# EAGLE design TrackerBaseStation (EAGLE 6.2)
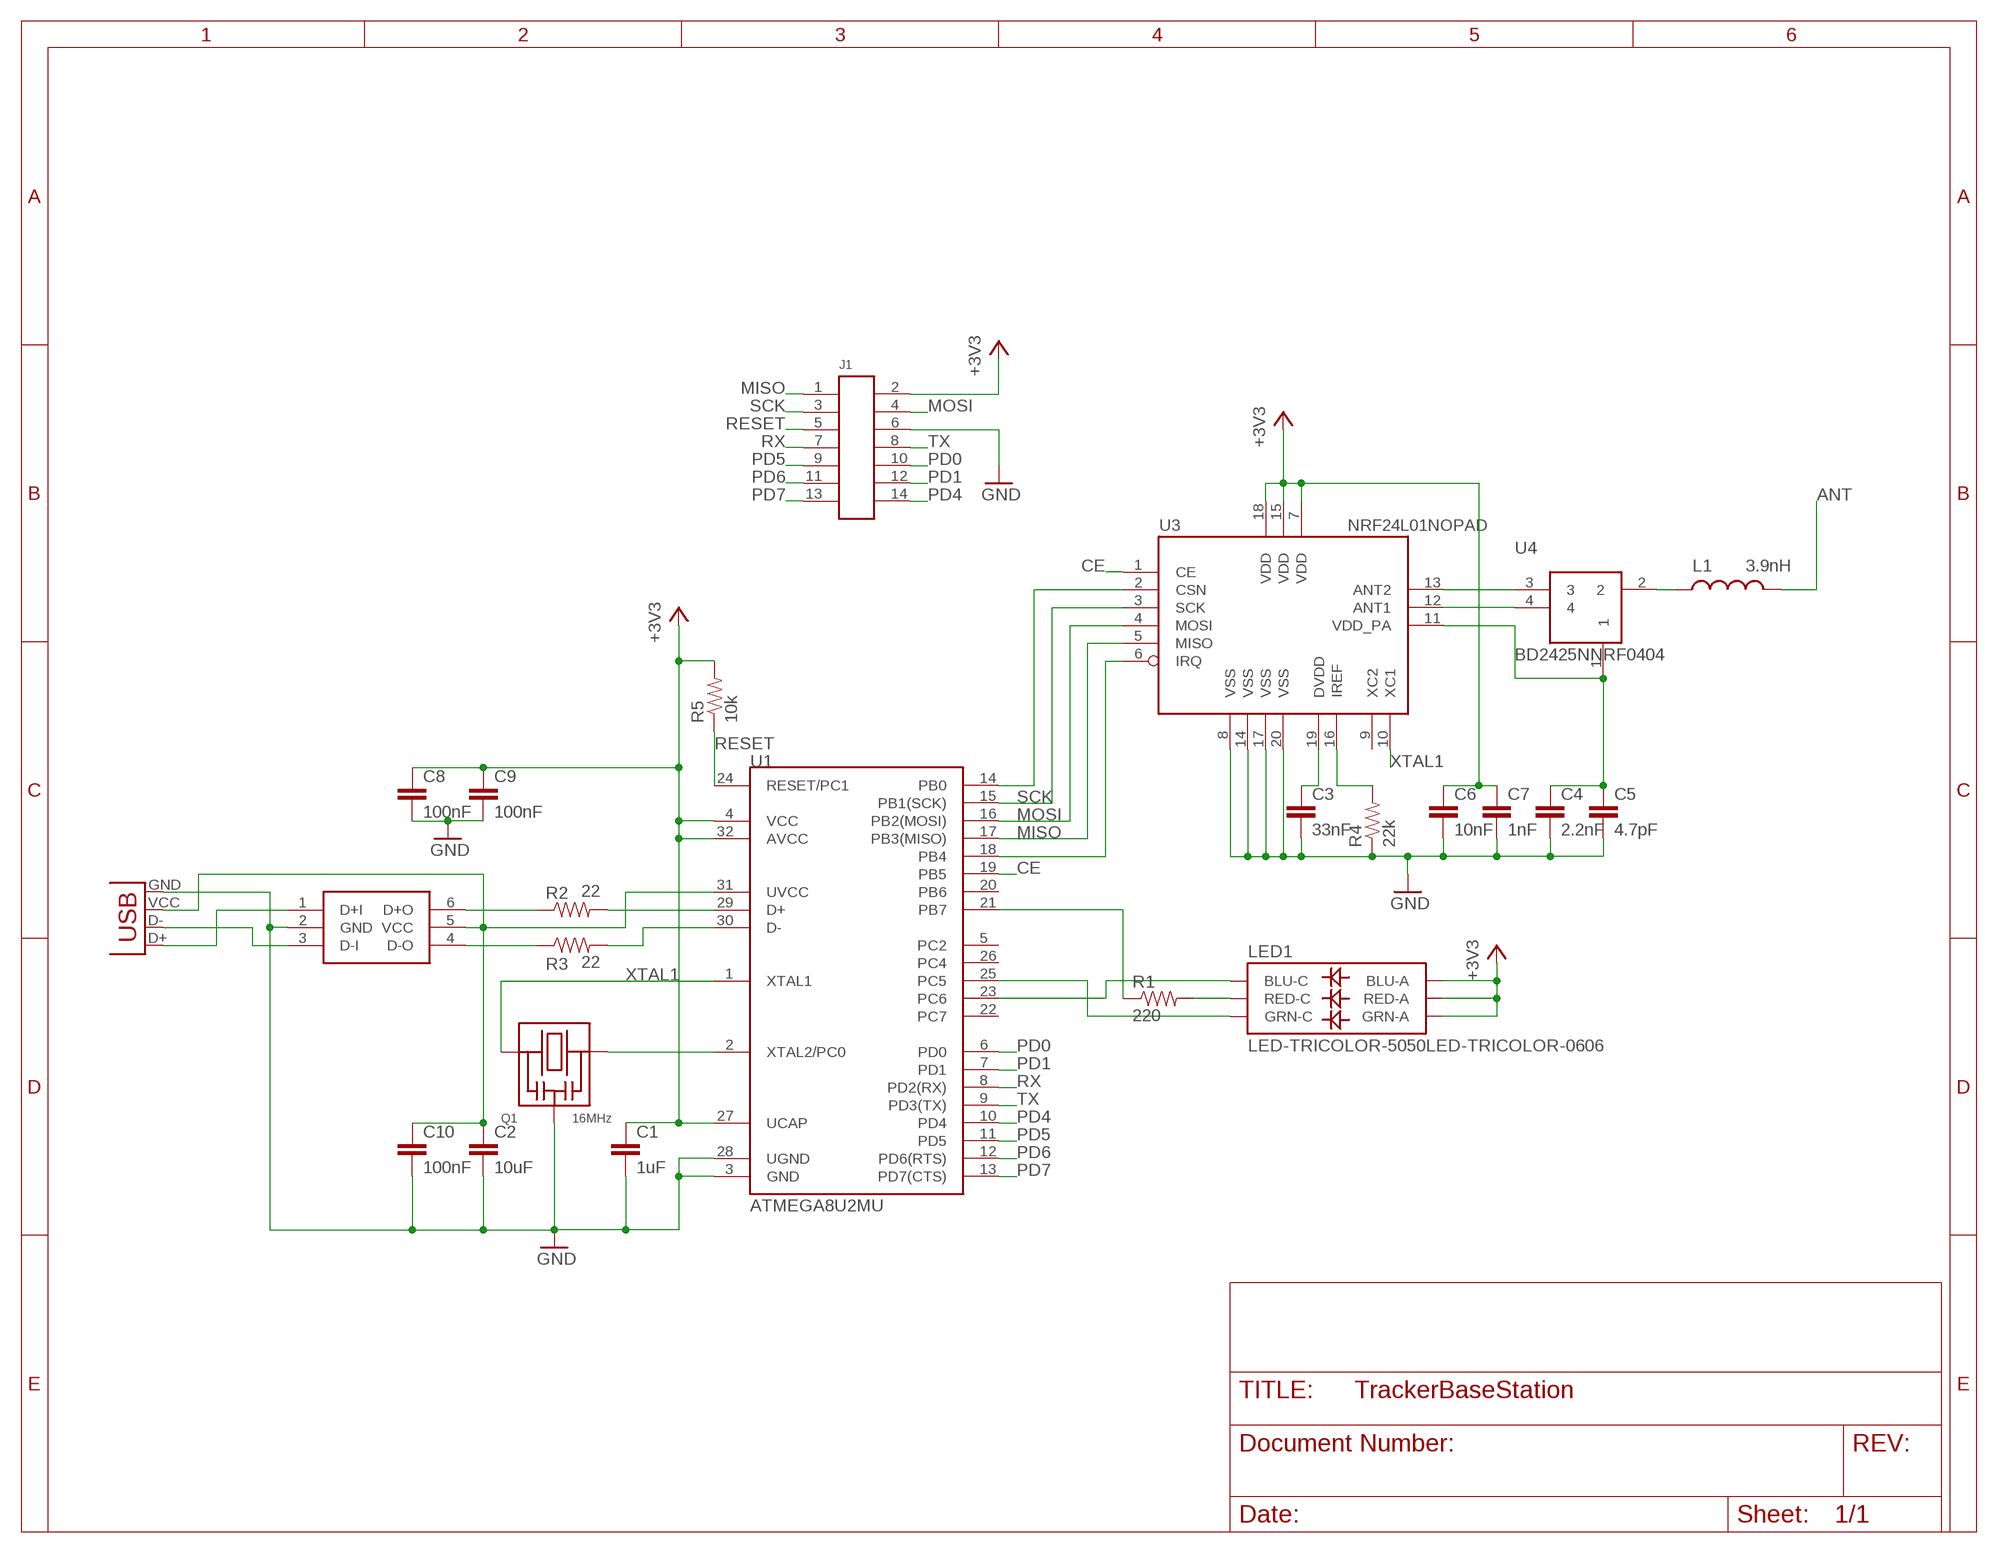
[diagram p0: schematic, sheet 1]

## Parts
C1  1uF  CAP0402-CAP  [0402-CAP]
C2  10uF  CAP0603-CAP  [0603-CAP]
C3  33nF  CAP0402-CAP  [0402-CAP]
C4  2.2nF  CAP0402-CAP  [0402-CAP]
C5  4.7pF  CAP0402-CAP  [0402-CAP]
C6  10nF  CAP0402-CAP  [0402-CAP]
C7  1nF  CAP0402-CAP  [0402-CAP]
C8  100nF  CAP0402-CAP  [0402-CAP]
C9  100nF  CAP0402-CAP  [0402-CAP]
C10  100nF  CAP0402-CAP  [0402-CAP]
J1  DF12A3.0-14DS  [DF12A3.0-14DS]
L1  3.9nH  INDUCTOR0402  [C0402]
LED1  LED-TRICOLOR-5050LED-TRICOLOR-0606  [0606]
Q1  16MHz  RESONATORPRQC  [PRQC]
R1  220  RESISTOR0402-RES  [0402-RES]
R2  22  RESISTOR0402-RES  [0402-RES]
R3  22  RESISTOR0402-RES  [0402-RES]
R4  22k  RESISTOR0402-RES  [0402-RES]
R5  10k  RESISTOR0402-RES  [0402-RES]
U1  ATMEGA8U2MU  [QFN32]
U2  RCLAMP0502A  [SOT-666]
U3  NRF24L01NOPAD  [QFN20-NOPAD]
U4  BD2425NNRF0404  [BD2425NNRF]
X1  USB-LEG  [USB-A-SMD-LEG]

## Nets
+3V3: C1.1 C6.1 C7.1 C8.1 C9.1 J1.2 LED1.4(BLU-A) LED1.5(RED-A) LED1.6(GRN-A) R5.2 U1.4(VCC) U1.27(UCAP) U1.32(AVCC) U3.7(VDD) U3.15(VDD) U3.18(VDD)
ANT: L1.2
CE: U1.19(PB5) U3.1(CE)
GND: C1.2 C2.2 C3.2 C4.2 C5.2 C6.2 C7.2 C8.2 C9.2 C10.2 J1.6 Q1.P$2(GND) R4.1 U1.3(GND) U1.28(UGND) U2.2(GND) U3.8(VSS) U3.14(VSS) U3.17(VSS) U3.20(VSS) X1.GND
MISO: J1.1 U1.17(PB3(MISO)) U3.5(MISO)
MOSI: J1.4 U1.16(PB2(MOSI)) U3.4(MOSI)
N$1: LED1.1(BLU-C) U1.23(PC6)
N$2: LED1.2(RED-C) R1.2
N$3: R1.1 U1.21(PB7)
N$4: LED1.3(GRN-C) U1.25(PC5)
N$5: Q1.P$3 U1.2(XTAL2/PC0)
N$6: U2.3(D-I) X1.D-
N$7: U2.1(D+I) X1.D+
N$8: U1.14(PB0) U3.2(CSN)
N$9: R2.1 U2.6(D+O)
N$10: R2.2 U1.29(D+)
N$11: R3.1 U2.4(D-O)
N$12: R3.2 U1.30(D-)
N$13: C2.1 C10.1 U1.31(UVCC) U2.5(VCC) X1.VCC(VBUS)
N$17: U1.18(PB4) U3.6(IRQ)
N$19: C3.1 U3.19(DVDD)
N$20: R4.2 U3.16(IREF)
N$21: U3.13(ANT2) U4.3
N$22: U3.12(ANT1) U4.4
N$23: L1.1 U4.2
N$24: C4.1 C5.1 U3.11(VDD_PA) U4.1
PD0: J1.10 U1.6(PD0)
PD1: J1.12 U1.7(PD1)
PD4: J1.14 U1.10(PD4)
PD5: J1.9 U1.11(PD5)
PD6: J1.11 U1.12(PD6(RTS))
PD7: J1.13 U1.13(PD7(CTS))
RESET: J1.5 R5.1 U1.24(RESET/PC1)
RX: J1.7 U1.8(PD2(RX))
SCK: J1.3 U1.15(PB1(SCK)) U3.3(SCK)
TX: J1.8 U1.9(PD3(TX))
XTAL1: Q1.P$1 U1.1(XTAL1) U3.10(XC1)
Unconnected: U1.5(PC2) U1.20(PB6) U1.22(PC7) U1.26(PC4) U3.9(XC2)

## Library data of the parts
C1-C3 C8-C10 = SparkFun-Passives:CAP: Capacitor Standard 0603 ceramic capacitor, and 0.1" leaded capacitor.
C4-C7 = SparkFun:CAP: Capacitor Standard 0603 ceramic capacitor, and 0.1" leaded capacitor.
J1 = adjacent-reality:DF12A3.0-14DS
L1 = adjacent-reality:INDUCTOR: Inductors Basic Inductor/Choke - 0603 and 1206. Footprints are not proven and vary greatly between part numbers. CC-BY-SA from SparkFun
LED1 = adjacent-reality:LED-TRICOLOR-5050
Q1 = adjacent-reality:RESONATOR: From UBW USB Bit Whacker by Brian Schmalz
R1-R5 = SparkFun-Passives:RESISTOR: Resistor Basic schematic elements and footprints for 0603, 1206, and PTH resistors.
U1 = adjacent-reality:ATMEGA8U2: Atmel 32-pin 8-bit Microcontroller with 8/16/32K Bystes of ISP Flash and USB Controller. ATmega8U2, ATmega16U2, and ATmega32U2 CC BY SA SparkFun
U2 = adjacent-reality:RCLAMP0502A: The RailClamp® series consists of ultra low capacitance TVS arrays designed to protect high speed data interfaces.
U3 = adjacent-reality:NRF24L01: 2.4GHz Low Power Transceiver This is the very popular, low cost, very low power RF transceiver from Nordic Semiconductor. Simple SPI interface. SKU: COM-00690 CC BY SA SparkFun
U4 = adjacent-reality:BD2425NNRF: Ultra Low Profile 0404 Balun For nRF24L01 and nRF24L01+
X1 = adjacent-reality:USB: USB Connectors USB-B-PTH is fully proven SKU : PRT-00139 USB-miniB is fully proven SKU : PRT-00587 USB-A-PCB is untested. USB-A-H is throughly reviewed, but untested. Spark Fun Electronics SKU : PRT-00437 USB-B-SMT is throughly reviewed, but untested. Needs silkscreen touching up. USB-A-S has not been used/tested USB-MB-H has not been used/tested CC BY SA SparkFun

## Board
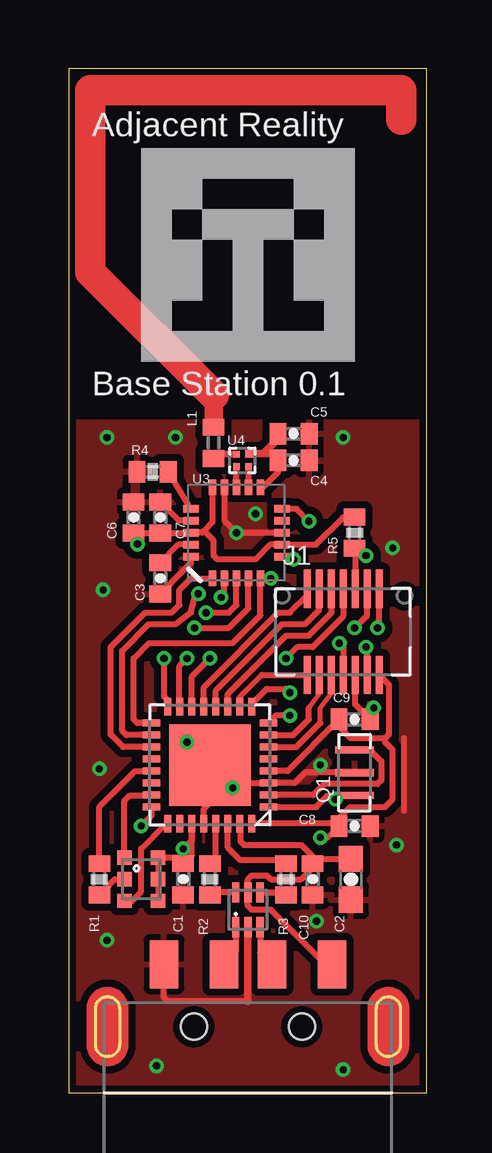
[diagram p1: board, top side]
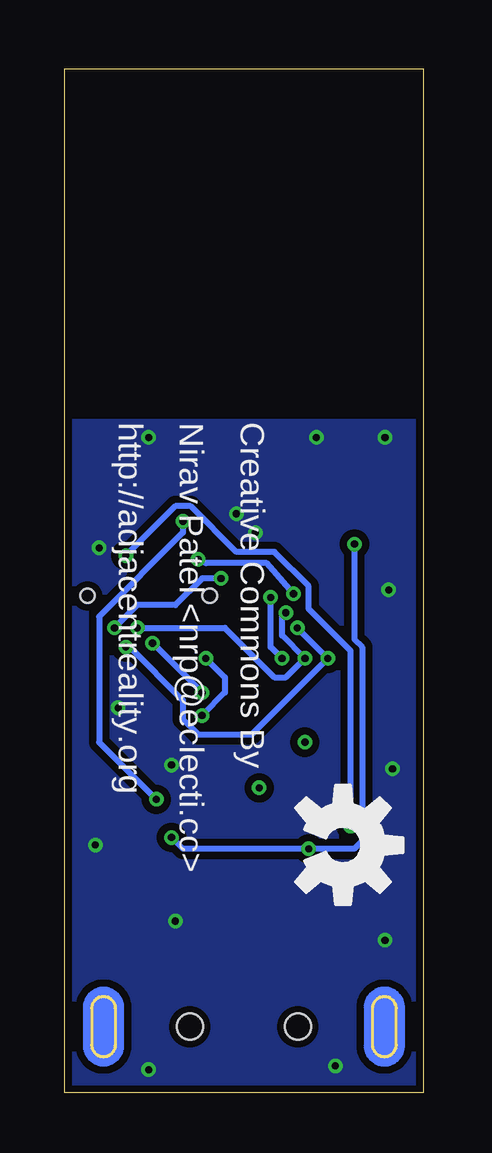
[diagram p2: board, bottom side, seen from below]

Size 14.92 x 42.67 mm. Coordinates in mm from the lower left corner, seen from the top.
Outline: 0,0 14.92,0 14.92,42.67 0,42.67 0,0
Copper layers (1*16): Top 0.035mm / dielectric 1.5mm / Bottom 0.035mm
Design rules: minimum track width 6mil, minimum drill 12mil, track to track 6mil, track to pad 6mil, pad to pad 6mil, via to via 6mil, smd to smd 0mil, copper to edge 10mil, drill to drill 10mil, minimum pad ring 10mil, minimum via ring 6mil, stop-mask expansion 2mil, vias tented up to drill 100mil, thermal gap 10mil

### Footprints (pad centres in the part's own frame; a part is rotated, then mirrored left to right if it is on the bottom)
0402-CAP = smd 0.7 x 0.9: 1 -0.65,0; 2 0.65,0
0603-CAP = smd 1.1 x 1: 1 -0.85,0; 2 0.85,0
DF12A3.0-14DS = smd 0.3 x 1.6: 1 1.5,1.8; 2 1.5,-1.8; 3 1,1.8; 4 1,-1.8; 5 0.5,1.8; 6 0.5,-1.8; 7 0,1.8; 8 0,-1.8; 9 -0.5,1.8; 10 -0.5,-1.8; 11 -1,1.8; 12 -1,-1.8; 13 -1.5,1.8; 14 -1.5,-1.8 | hole 0.6: -2.55,1.5; 2.55,1.5
C0402 = smd 0.7 x 0.9: 1 -0.65,0; 2 0.65,0
0606 = smd 0.6 x 0.6: 1 -0.7,0.9; 2 -0.7,0; 3 -0.7,-0.9; 4 0.7,0.9; 5 0.7,0; 6 0.7,-0.9
PRQC = smd 0.3 x 1.6: P$1 -0.95,0; P$2 0,0; P$3 0.95,0
0402-RES = smd 0.7 x 0.9: 1 -0.65,0; 2 0.65,0
QFN32 = smd 3.4 x 3.4: 0 0,0 | smd 0.725 x 0.3: 1 -2.438,1.75; 2 -2.438,1.25; 3 -2.438,0.75; 4 -2.438,0.25; 5 -2.438,-0.25; 6 -2.438,-0.75; 7 -2.438,-1.25; 8 -2.438,-1.75; 17 2.438,-1.75; 18 2.438,-1.25; 19 2.438,-0.75; 20 2.438,-0.25; 21 2.438,0.25; 22 2.438,0.75; 23 2.438,1.25; 24 2.438,1.75 | smd 0.3 x 0.725: 9 -1.75,-2.438; 10 -1.25,-2.438; 11 -0.75,-2.438; 12 -0.25,-2.438; 13 0.25,-2.438; 14 0.75,-2.438; 15 1.25,-2.438; 16 1.75,-2.438; 25 1.75,2.438; 26 1.25,2.438; 27 0.75,2.438; 28 0.25,2.438; 29 -0.25,2.438; 30 -0.75,2.438; 31 -1.25,2.438; 32 -1.75,2.438
SOT-666 = smd 0.305 x 0.838: 1 -0.508,-0.724; 2 0,-0.724; 3 0.508,-0.724; 4 0.508,0.724; 5 0,0.724; 6 -0.508,0.724
QFN20-NOPAD = smd 0.65 x 0.3: 1 -1.9,1; 2 -1.9,0.5; 3 -1.9,0; 4 -1.9,-0.5; 5 -1.9,-1; 11 1.9,-1; 12 1.9,-0.5; 13 1.9,0; 14 1.9,0.5; 15 1.9,1 | smd 0.3 x 0.65: 6 -1,-1.9; 7 -0.5,-1.9; 8 0,-1.9; 9 0.5,-1.9; 10 1,-1.9; 16 1,1.9; 17 0.5,1.9; 18 0,1.9; 19 -0.5,1.9; 20 -1,1.9
BD2425NNRF = smd 0.356 x 0.356: 1 0.292,0.292 | smd 0.279 x 0.279: 2 -0.254,0.254; 3 -0.254,-0.254; 4 0.254,-0.254
USB-A-SMD-LEG = smd 1.2 x 2: D+ -1,2.6; D- 1,2.6; GND -3.5,2.6; VCC 3.5,2.6 | hole 1.1: -2.25,0; 2.25,0

### Placement (x,y rotation side)
C1  4.76,8.89 270 top
C2  11.75,8.89 270 top
C3  3.81,21.43 270 top
C4  9.37,26.35 0 top
C5  9.37,27.46 0 top
C6  2.7,23.97 90 top
C7  3.81,23.97 90 top
C8  11.91,11.11 0 top
C9  11.91,15.56 0 top
C10  10.16,8.89 270 top
J1  11.43,19.21 0 top
L1  6.03,27.08 90 top
LED1  3.02,8.89 0 top
Q1  11.91,13.34 90 top
R1  1.27,8.89 270 top
R2  5.87,8.89 90 top
R3  9.05,8.89 90 top
R4  3.49,25.88 0 top
R5  11.91,23.34 90 top
U1  5.87,13.65 180 top
U2  7.46,7.62 0 top
U3  6.99,23.34 90 top
U4  7.24,26.35 0 top
U$1  [ADJACENTREALITY-LOGO-0.35]  7.46,34.92 0 top
U$2  [OSHW-LOGO-M]  3.33,10.32 270 bottom
X1  7.46,2.75 0 top

### Tracks (layer width: path | path; a pad name or v marks a point on that pad's centre or on a via)
+3V3  (via drill 0.3)
  Top 0.254: U3.15 5.99,23.77 5.64,23.42 | 5.64,23.42 5.56,23.34 U3.18 5.07,23.32 C7.1 C6.1 2.86,23.16 v2.86,22.86 | 5.64,23.42 6.03,23.02 6.03,22.38 6.19,22.23 7.78,22.23 8.39,22.84 U3.7 10.29,22.84 11.43,23.97 11.89,23.97 R5.2 | LED1.6 LED1.5 LED1.4 4.51,9.79 C1.1 5.12,9.9 U1.27 5.12,10.52 v4.76,10.16 | 11.04,11.21 C8.1 10.78,10.64 v10.48,10.64 | 11.04,11.21 U1.32 | U1.4 9.12,13.4 9.53,13.81 10.79,15.1 C9.1 11.26,15.26 11.75,14.76 13.18,14.76 | J1.2 13.34,17 13.34,14.92 13.18,14.76 | 11.04,11.21 11.73,11.91 13.18,11.91 13.49,12.22 13.49,14.29 13.18,14.61 13.18,14.76
  Bottom 0.254: v10.48,10.64 10,10.16 v4.76,10.16 2.86,10.16 2.22,10.79 2.22,11.27 2.54,11.59 2.54,18.57 2.86,18.89 v2.86,22.86
ANT
  Top 0.254: L1.2 6.03,27.94
  Top 0.762: 6.03,27.94 6.03,29.07
  Top 1.27: 13.86,40.55 13.86,41.77 0.9,41.77 0.9,34.2 6.03,29.07
CE
  Top 0.254: U1.19 2.27,14.4 1.75,14.92 1.75,18.57 3.17,20 4.29,20 4.6,20.32 4.6,20.95 5.08,21.43 U3.1
GND  (via drill 0.3)
  Top 0.254: U3.17 4.59,23.84 C7.2 | U1.28 5.62,11.81 6.71,12.9 U1.3 9.41,12.9 9.84,13.34 Q1.P$2 | 7.46,3.81 4.13,3.81 3.96,3.98 X1.GND | U3.14 6.49,23.84 v6.99,23.34 U3.8 | 10,26.34 C4.2 | U3.20 5.08,22.07 4.29,21.27 4.29,21.26 C3.2 | J1.6 11.93,16.18 C9.2 12.56,15.89 v12.7,16.03 | 13.97,11.75 13.97,14.76
  Top 0.305: U2.2 7.46,3.81
  other vias: 1.59,27.3 4.45,27.3 11.43,27.3 7.78,24.13 1.43,20.95 13.49,22.7 10.48,13.65 13.65,10.32 1.27,13.49 1.59,6.35 3.65,1.11 11.43,0.95 10.32,7.14
  pour Top (isolate 0.305): 0,0 0,27.94 14.92,27.94 14.92,0
  pour Bottom (isolate 0.305): 0,0 0,27.94 14.92,27.94 14.92,0
MISO  (via drill 0.3)
  Top 0.254: U1.17 2.85,15.4 2.7,15.56 2.7,18.1 3.33,18.73 6.83,18.73 7.99,19.89 7.99,21.32 | 7.99,21.32 U3.5 | v12.86,19.37 arc90 12.93,19.44 J1.1 | 7.99,21.32 8.1,21.43 v8.41,21.43
  Bottom 0.254: v8.41,21.43 9.21,21.43 10.32,20.32 11.91,20.32 v12.86,19.37
MOSI  (via drill 0.3)
  Top 0.254: U1.16 4.13,16.35 3.97,16.51 v3.97,18.1 | v5.24,19.37 6.67,19.37 7.49,20.18 U3.4 | J1.4 12.43,18.37 12.22,18.57 v12.38,18.57
  Bottom 0.254: v5.24,19.37 v3.97,18.1 7.14,14.92 9.37,14.92 10,15.56 10,16.35 12.22,18.57 v12.38,18.57
N$1
  Top 0.254: LED1.1 2.32,12.16 2.54,12.38 3.42,12.38 U1.23
N$2
  Top 0.254: R1.2 1.92,8.89 LED1.2
N$3
  Top 0.254: R1.1 1.27,11.91 2.77,13.4 U1.21
N$4
  Top 0.254: U1.25 3.96,11.11 3.02,10.16 3.02,8.37 2.63,7.99 LED1.3
N$5
  Top 0.254: Q1.P$3 12.54,14.29 13.02,13.81 13.02,13.02 12.86,12.86 10.64,12.86 10.18,12.4 U1.2
N$6
  Top 0.254: U2.3 7.97,5.84 X1.D-
N$7
  Top 0.254: U2.1 6.95,5.84 X1.D+
N$8  (via drill 0.3)
  Top 0.254: U1.14 5.12,17.35 v5.87,18.1 | v6.35,20.64 6.49,20.77 U3.2
  Bottom 0.254: v5.87,18.1 6.35,18.57 v6.35,20.64
N$9
  Top 0.254: U2.6 5.98,8.34 R2.1
N$10
  Top 0.254: R2.2 6.12,9.79 U1.29
N$11
  Top 0.254: U2.4 8.95,8.34 R3.1
N$12
  Top 0.254: R3.2 8.9,9.68 7.14,9.68 6.62,10.2 U1.30
N$13
  Top 0.254: C10.1 10.16,9.37 9.68,8.89 8.41,8.89 8.26,9.05 7.62,9.05 7.46,8.89 U2.5 7.46,7.78 7.62,7.62 8.41,7.62 10.68,5.35 X1.VCC | C10.1 10.36,9.74 C2.1 | U1.31 7.14,10.88 7.14,10.48 7.3,10.32 9.68,10.32 10.16,9.84 C10.1
N$15  (via drill 0.3)
  other vias: 4.92,14.61
N$16  (via drill 0.3)
  other vias: 6.83,12.7
N$17  (via drill 0.3)
  Top 0.254: U1.18 2.4,14.9 2.22,15.08 2.22,18.41 3.33,19.53 4.45,19.53 5.08,20 5.24,20.64 v5.4,20.8 | v9.37,22.23 9.32,22.34 U3.6
  Bottom 0.254: v5.4,20.8 6.51,22.07 9.05,22.07 v9.37,22.23
N$19
  Top 0.254: U3.19 4.57,22.84 C3.1
N$20
  Top 0.254: U3.16 R4.2
N$21
  Top 0.254: U3.13 U4.3
N$22
  Top 0.254: U4.4 U3.12
N$23
  Top 0.254: 6.21,26.61 L1.1
  Top 0.279: U4.2 6.21,26.61
N$24
  Top 0.254: 8.42,26.64 C4.1 8.72,25.86 8.1,25.24 U3.11 | C5.1 8.72,27.27
  Top 0.305: U4.1 8.1,26.64 | 8.1,26.64 8.42,26.64 | 8.72,27.27 8.1,26.64
PD0
  Top 0.203: 10.48,15.4 10.48,16.03 10.93,16.64
  Top 0.254: U1.6 9.48,14.4 10.48,15.4 | 10.93,16.64 J1.10
PD1
  Top 0.203: 10,16.03 10.43,16.62 J1.12
  Top 0.254: U1.7 9.35,14.9 10,15.56 10,16.03
PD4
  Top 0.203: 7.12,16.49 8.04,17.41
  Top 0.254: U1.10 7.12,16.49 | 8.04,17.41 J1.14
PD5
  Top 0.254: U1.11 6.62,16.62 9.05,19.05 10,19.05 10.95,20 10.95,20.98 J1.9
PD6
  Top 0.254: U1.12 6.12,16.76 8.89,19.53 9.84,19.53 10.43,20.11 J1.11
PD7
  Top 0.254: U1.13 5.62,16.89 8.73,20 9.21,20 9.93,20.73 J1.13
RESET  (via drill 0.3)
  Top 0.254: J1.5 11.93,22.66 R5.1 12.21,22.38 v12.38,22.38 | U1.24 3.44,11.53 v3.02,11.11
  Bottom 0.254: v3.02,11.11 3.02,18.41 4.76,20.16 4.76,21.11 6.19,22.54 7.78,22.54 9.68,24.45 10.32,24.45 v12.38,22.38
RX  (via drill 0.3)
  Top 0.254: J1.7 11.43,19.84 10.16,18.57 9.53,18.57 v9.05,18.1 | v9.21,15.72 8.62,15.72 U1.8
  Bottom 0.254: v9.05,18.1 8.26,17.3 8.26,16.67 v9.21,15.72
SCK  (via drill 0.3)
  Top 0.254: U1.15 4.6,16.11 4.6,17.78 v4.92,18.1 | v5.71,20 6.67,20 6.99,20.32 U3.3 | v11.91,19.37 12.43,19.89 J1.3
  Bottom 0.254: v5.71,20 5.87,19.84 5.87,19.05 v4.92,18.1 5.71,17.3 6.19,17.3 8.26,19.37 v11.91,19.37
TX  (via drill 0.3)
  Top 0.254: U1.9 7.62,16.2 8.26,16.83 9.05,16.83 v9.21,16.67 | v11.27,18.73 11.43,18.57 J1.8
  Bottom 0.254: v9.21,16.67 v11.27,18.73
XTAL1  (via drill 0.3)
  Top 0.254: U1.1 10.31,11.9 10.8,12.38 11.27,12.38 | 11.27,12.38 Q1.P$1 | U3.10 9.48,24.34 v10,23.81 | v11.11,12.22 v11.11,12.23 11.27,12.38
  Bottom 0.254: v10,23.81 10,23.34 13.49,19.84 13.49,14.61 v11.11,12.22

### Text on the board
tPlace: Adjacent Reality | Base Station 0.1
bPlace: Creative Commons By | Nirav Patel <nrp@eclecti.cc> | http://adjacentreality.org